# EAGLE design Nutrient Management Control (EAGLE 9.6.2)
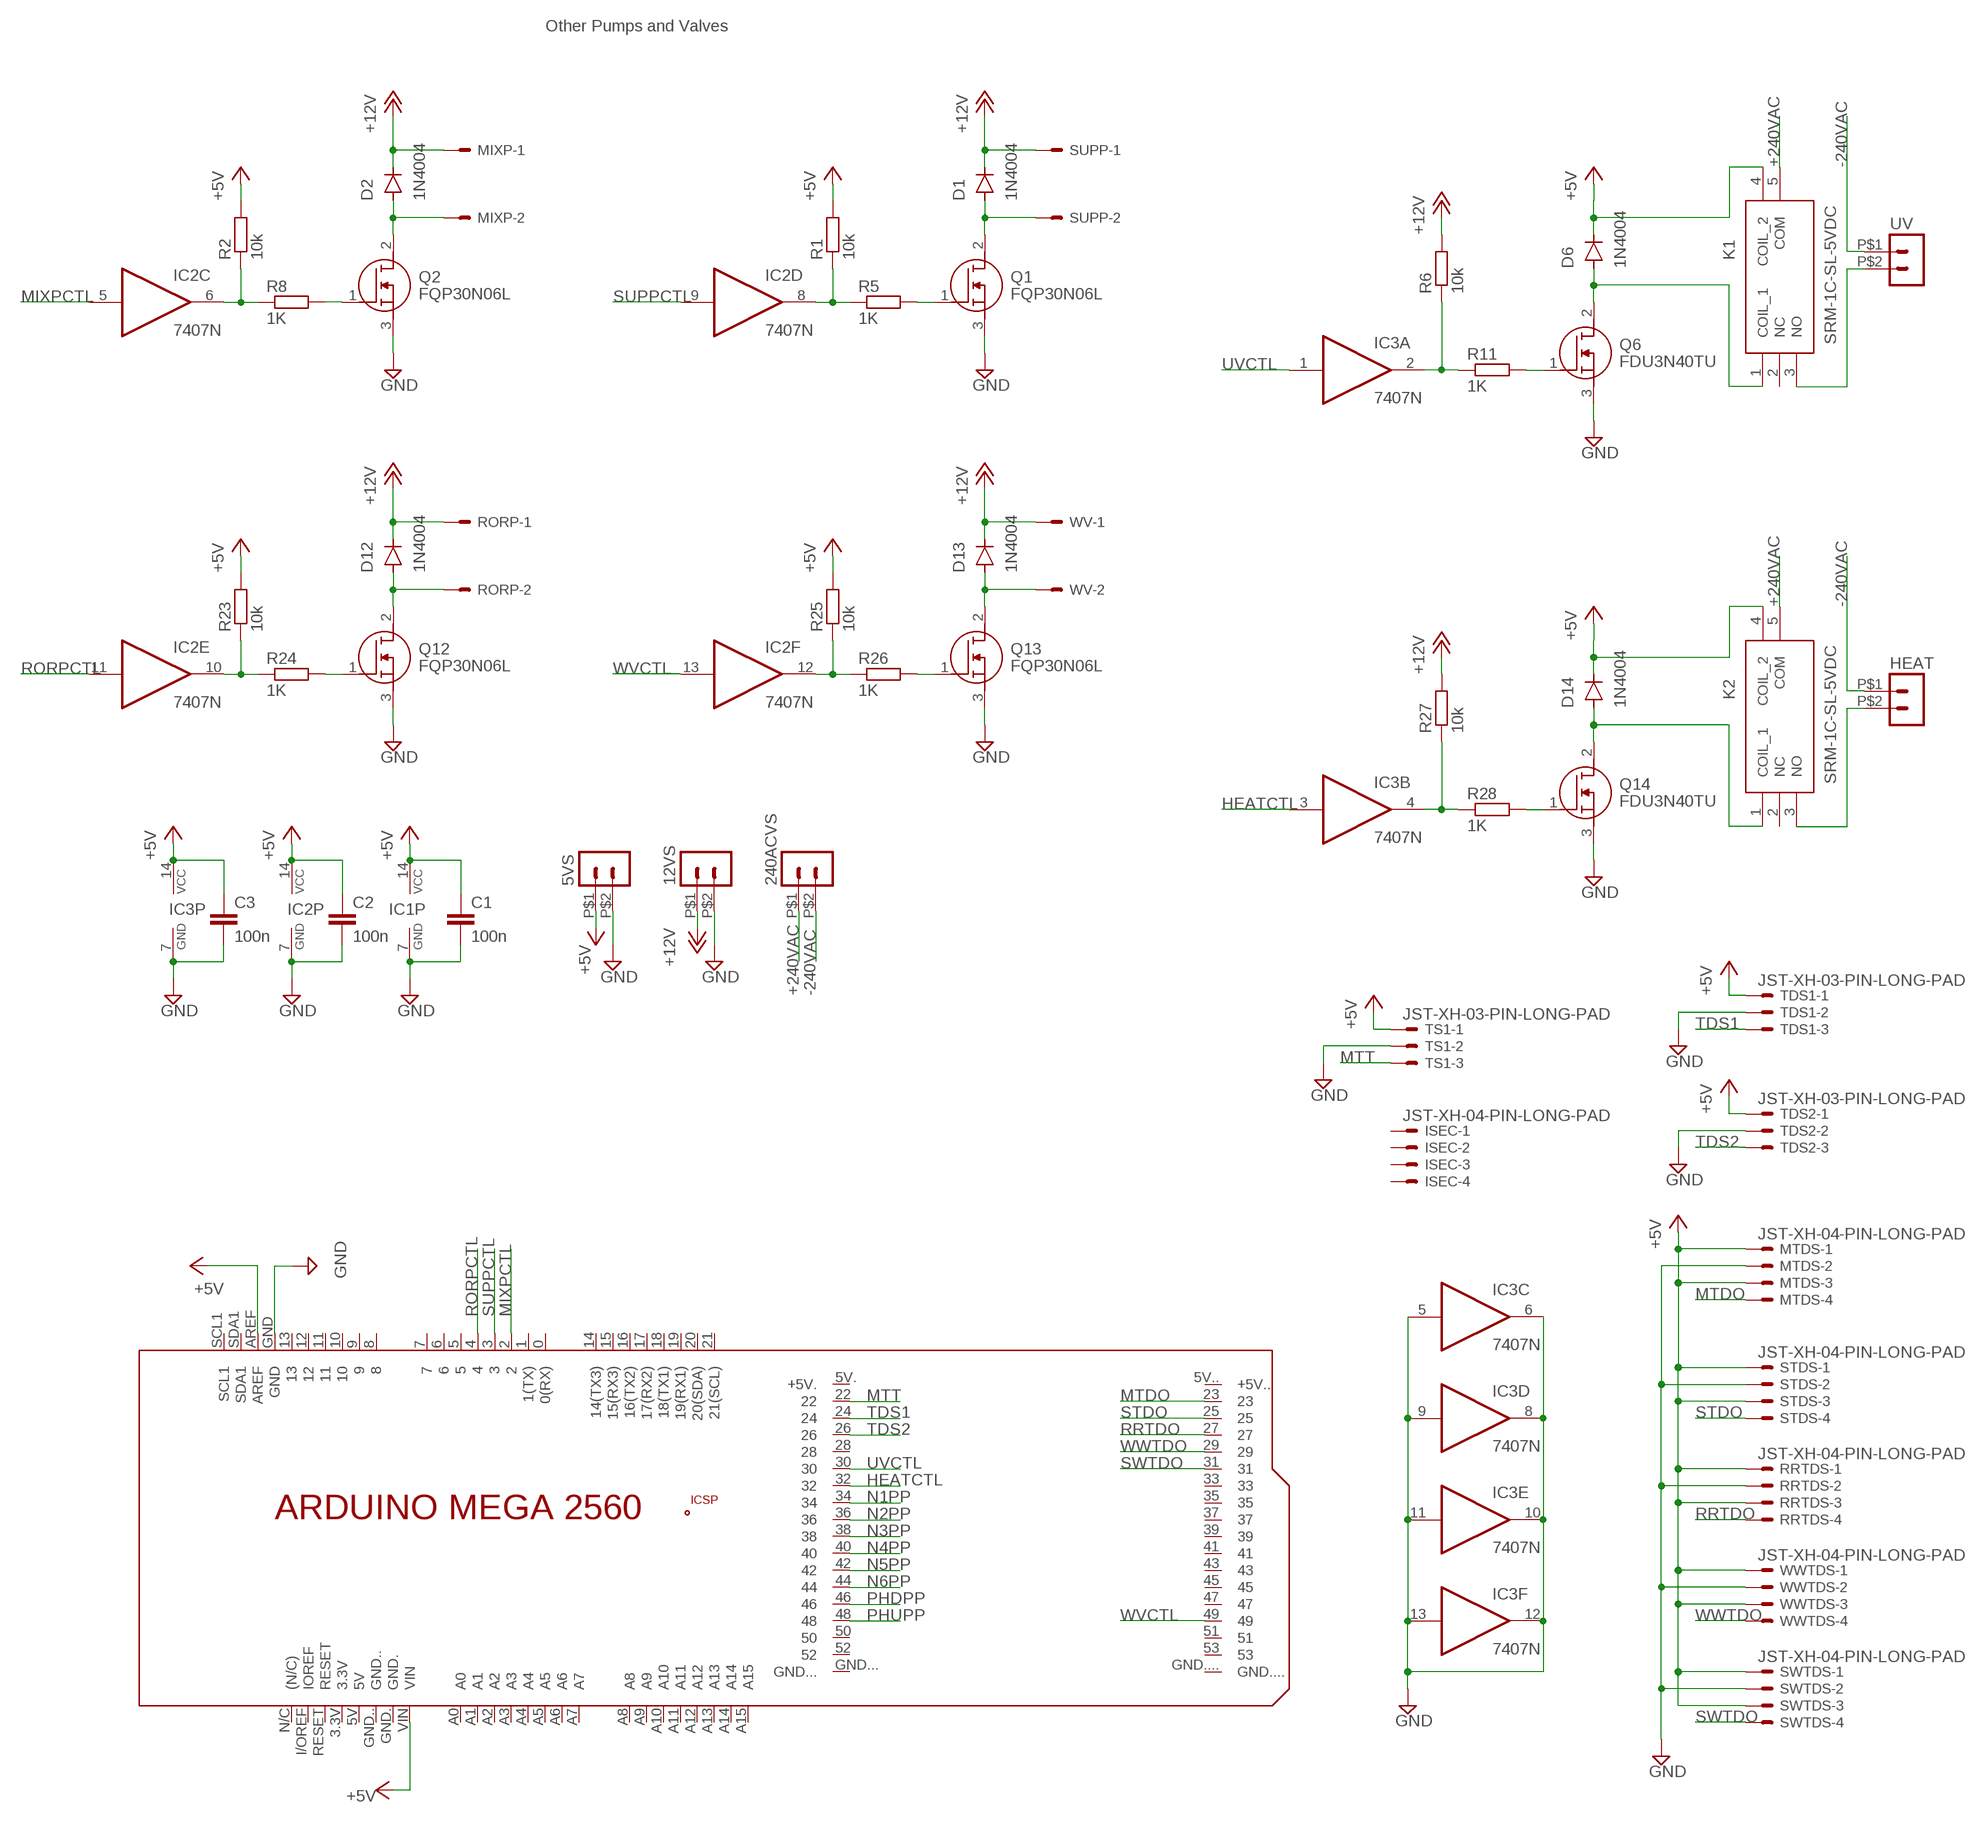
[diagram p0: schematic, sheet 1, part 1 of 2]
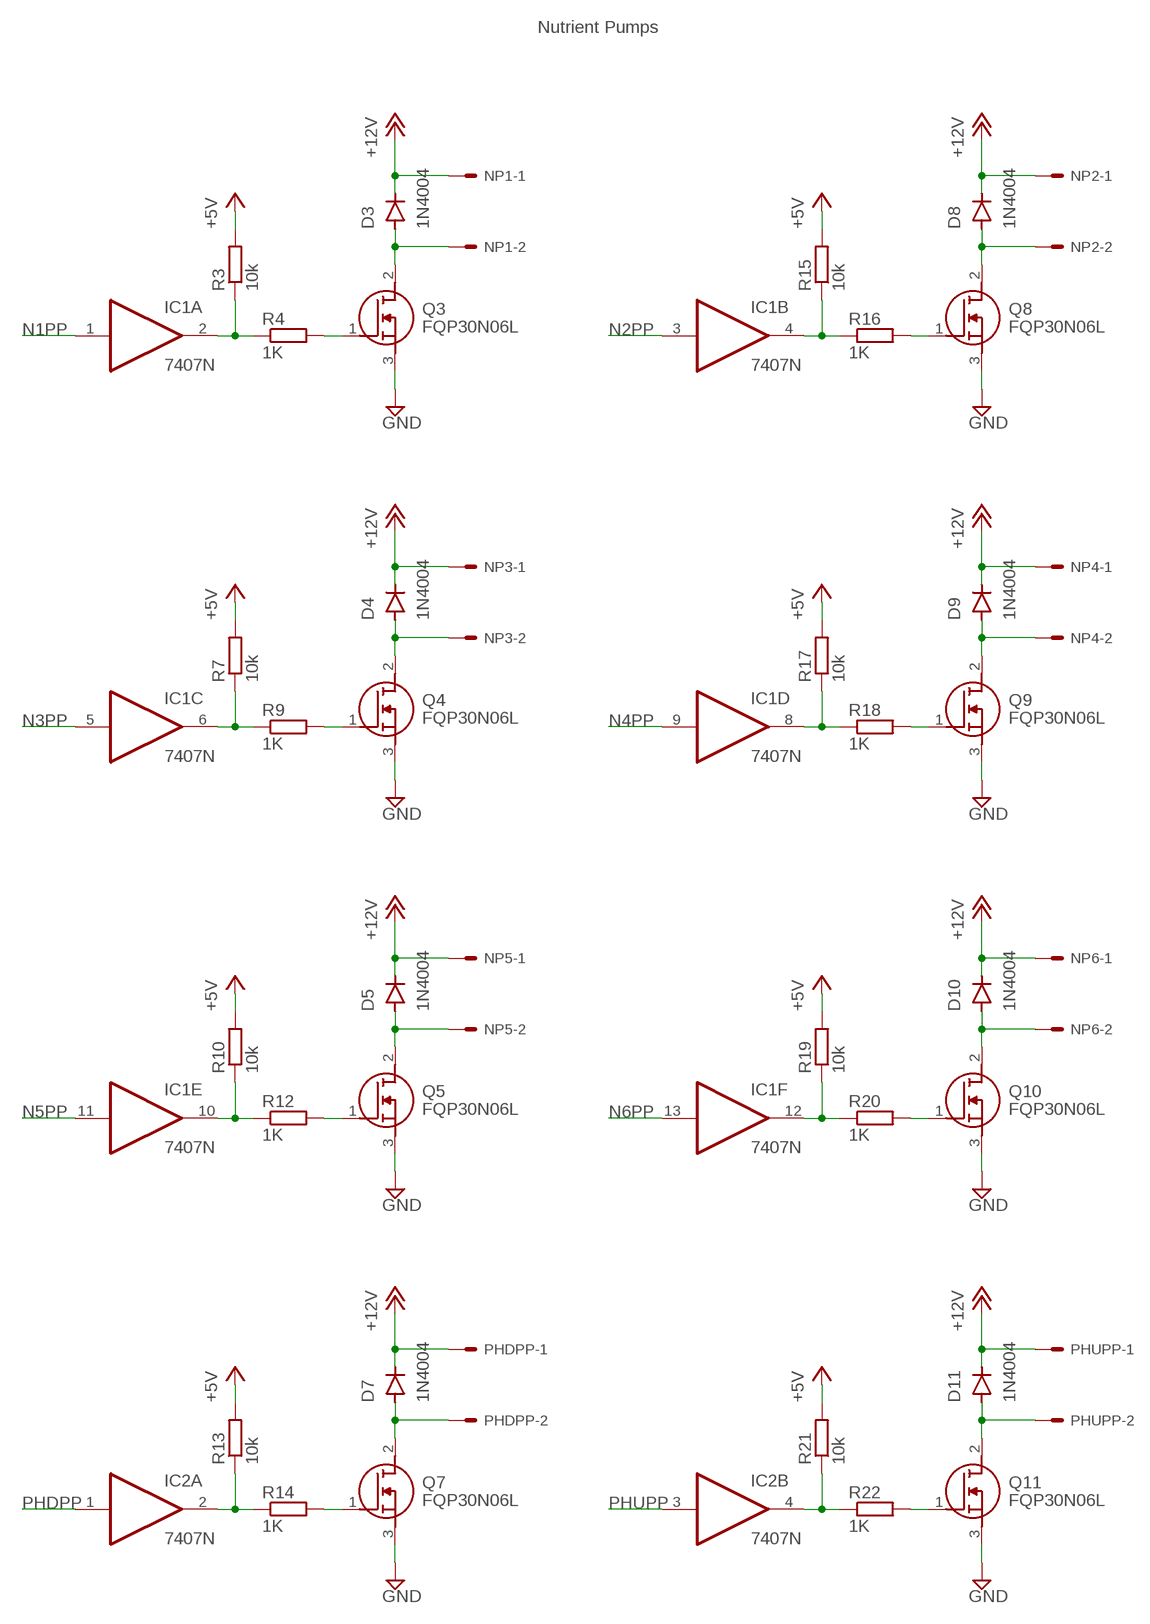
[diagram p1: schematic, sheet 1, part 2 of 2]

## Parts
5VS  HEADER_POS2_43650-0215  [43650-0215]
12VS  HEADER_POS2_43650-0215  [43650-0215]
240ACVS  HEADER_POS2_43650-0215  [43650-0215]
C1  100n  C-EU050-024X044  [C050-024X044]
C2  100n  C-EU050-024X044  [C050-024X044]
C3  100n  C-EU050-024X044  [C050-024X044]
D1  1N4004  [DO-41]
D2  1N4004  [DO-41]
D3  1N4004  [DO-41]
D4  1N4004  [DO-41]
D5  1N4004  [DO-41]
D6  1N4004  [DO-41]
D7  1N4004  [DO-41]
D8  1N4004  [DO-41]
D9  1N4004  [DO-41]
D10  1N4004  [DO-41]
D11  1N4004  [DO-41]
D12  1N4004  [DO-41]
D13  1N4004  [DO-41]
D14  1N4004  [DO-41]
HEAT  HEADER_POS2_43650-0215  [43650-0215]
IC1  7407N  [DIL14]
IC2  7407N  [DIL14]
IC3  7407N  [DIL14]
ISEC  JST-XH-04-PIN-LONG-PAD  [JST-XH-04-PACKAGE-LONG-PAD]
K1  SRM-1C-SL-5VDC  [SRM1CSL5VDC]
K2  SRM-1C-SL-5VDC  [SRM1CSL5VDC]
MIXP  JST-XH-02-PIN-LONG-PAD  [JST-XH-02-PACKAGE-LONG-PAD]
MTDS  JST-XH-04-PIN-LONG-PAD  [JST-XH-04-PACKAGE-LONG-PAD]
NP1  JST-XH-02-PIN-LONG-PAD  [JST-XH-02-PACKAGE-LONG-PAD]
NP2  JST-XH-02-PIN-LONG-PAD  [JST-XH-02-PACKAGE-LONG-PAD]
NP3  JST-XH-02-PIN-LONG-PAD  [JST-XH-02-PACKAGE-LONG-PAD]
NP4  JST-XH-02-PIN-LONG-PAD  [JST-XH-02-PACKAGE-LONG-PAD]
NP5  JST-XH-02-PIN-LONG-PAD  [JST-XH-02-PACKAGE-LONG-PAD]
NP6  JST-XH-02-PIN-LONG-PAD  [JST-XH-02-PACKAGE-LONG-PAD]
PCB2  ARDUINO_MEGA2560_SHIELD  [ARDUINO_MEGA2560_SHIELD]
PHDPP  JST-XH-02-PIN-LONG-PAD  [JST-XH-02-PACKAGE-LONG-PAD]
PHUPP  JST-XH-02-PIN-LONG-PAD  [JST-XH-02-PACKAGE-LONG-PAD]
Q1  FQP30N06L  [TO254P470X1016X2019-3P]
Q2  FQP30N06L  [TO254P470X1016X2019-3P]
Q3  FQP30N06L  [TO254P470X1016X2019-3P]
Q4  FQP30N06L  [TO254P470X1016X2019-3P]
Q5  FQP30N06L  [TO254P470X1016X2019-3P]
Q6  FDU3N40TU  [TO229P250X658X985-3P]
Q7  FQP30N06L  [TO254P470X1016X2019-3P]
Q8  FQP30N06L  [TO254P470X1016X2019-3P]
Q9  FQP30N06L  [TO254P470X1016X2019-3P]
Q10  FQP30N06L  [TO254P470X1016X2019-3P]
Q11  FQP30N06L  [TO254P470X1016X2019-3P]
Q12  FQP30N06L  [TO254P470X1016X2019-3P]
Q13  FQP30N06L  [TO254P470X1016X2019-3P]
Q14  FDU3N40TU  [TO229P250X658X985-3P]
R1  10k  R-EU_0204/7  [0204/7]
R2  10k  R-EU_0204/7  [0204/7]
R3  10k  R-EU_0204/7  [0204/7]
R4  1K  R-EU_0204/7  [0204/7]
R5  1K  R-EU_0204/7  [0204/7]
R6  10k  R-EU_0204/7  [0204/7]
R7  10k  R-EU_0204/7  [0204/7]
R8  1K  R-EU_0204/7  [0204/7]
R9  1K  R-EU_0204/7  [0204/7]
R10  10k  R-EU_0204/7  [0204/7]
R11  1K  R-EU_0204/7  [0204/7]
R12  1K  R-EU_0204/7  [0204/7]
R13  10k  R-EU_0204/7  [0204/7]
R14  1K  R-EU_0204/7  [0204/7]
R15  10k  R-EU_0204/7  [0204/7]
R16  1K  R-EU_0204/7  [0204/7]
R17  10k  R-EU_0204/7  [0204/7]
R18  1K  R-EU_0204/7  [0204/7]
R19  10k  R-EU_0204/7  [0204/7]
R20  1K  R-EU_0204/7  [0204/7]
R21  10k  R-EU_0204/7  [0204/7]
R22  1K  R-EU_0204/7  [0204/7]
R23  10k  R-EU_0204/7  [0204/7]
R24  1K  R-EU_0204/7  [0204/7]
R25  10k  R-EU_0204/7  [0204/7]
R26  1K  R-EU_0204/7  [0204/7]
R27  10k  R-EU_0204/7  [0204/7]
R28  1K  R-EU_0204/7  [0204/7]
RORP  JST-XH-02-PIN-LONG-PAD  [JST-XH-02-PACKAGE-LONG-PAD]
RRTDS  JST-XH-04-PIN-LONG-PAD  [JST-XH-04-PACKAGE-LONG-PAD]
STDS  JST-XH-04-PIN-LONG-PAD  [JST-XH-04-PACKAGE-LONG-PAD]
SUPP  JST-XH-02-PIN-LONG-PAD  [JST-XH-02-PACKAGE-LONG-PAD]
SWTDS  JST-XH-04-PIN-LONG-PAD  [JST-XH-04-PACKAGE-LONG-PAD]
TDS1  JST-XH-03-PIN-LONG-PAD  [JST-XH-03-PACKAGE-LONG-PAD]
TDS2  JST-XH-03-PIN-LONG-PAD  [JST-XH-03-PACKAGE-LONG-PAD]
TS1  JST-XH-03-PIN-LONG-PAD  [JST-XH-03-PACKAGE-LONG-PAD]
UV  HEADER_POS2_43650-0215  [43650-0215]
WV  JST-XH-02-PIN-LONG-PAD  [JST-XH-02-PACKAGE-LONG-PAD]
WWTDS  JST-XH-04-PIN-LONG-PAD  [JST-XH-04-PACKAGE-LONG-PAD]

## Nets
+5V [5V]: 5VS.P$1 C1.1 C2.1 C3.1 D6.C D14.C IC1.14(P:VCC) IC2.14(P:VCC) IC3.14(P:VCC) K1.4(COIL_2) K2.4(COIL_2) MTDS.1 MTDS.3 PCB2.AREF PCB2.VIN R1.2 R2.2 R3.2 R7.2 R10.2 R13.2 R15.2 R17.2 R19.2 R21.2 R23.2 R25.2 RRTDS.1 RRTDS.3 STDS.1 STDS.3 SWTDS.1 SWTDS.3 TDS1.1 TDS2.1 TS1.1 WWTDS.1 WWTDS.3
+12V [12V]: 12VS.P$1 D1.C D2.C D3.C D4.C D5.C D7.C D8.C D9.C D10.C D11.C D12.C D13.C MIXP.1 NP1.1 NP2.1 NP3.1 NP4.1 NP5.1 NP6.1 PHDPP.1 PHUPP.1 R6.2 R27.2 RORP.1 SUPP.1 WV.1
+240VAC [240VAC]: 240ACVS.P$1 K1.5(COM) K2.5(COM)
-240VAC [240VAC]: 240ACVS.P$2 HEAT.P$1 UV.P$1
GND: 5VS.P$2 12VS.P$2 C1.2 C2.2 C3.2 IC1.7(P:GND) IC2.7(P:GND) IC3.5(C:I) IC3.6(C:O) IC3.7(P:GND) IC3.8(D:O) IC3.9(D:I) IC3.10(E:O) IC3.11(E:I) IC3.12(F:O) IC3.13(F:I) MTDS.2 PCB2.GND Q1.3(S) Q2.3(S) Q3.3(S) Q4.3(S) Q5.3(S) Q6.3(S) Q7.3(S) Q8.3(S) Q9.3(S) Q10.3(S) Q11.3(S) Q12.3(S) Q13.3(S) Q14.3(S) RRTDS.2 STDS.2 SWTDS.2 TDS1.2 TDS2.2 TS1.2 WWTDS.2
HEATCTL: IC3.3(B:I) PCB2.32
MIXPCTL: IC2.5(C:I) PCB2.2
MTDO: MTDS.4 PCB2.23
MTT: PCB2.22 TS1.3
N1PP: IC1.1(A:I) PCB2.34
N2PP: IC1.3(B:I) PCB2.36
N3PP: IC1.5(C:I) PCB2.38
N4PP: IC1.9(D:I) PCB2.40
N5PP: IC1.11(E:I) PCB2.42
N6PP: IC1.13(F:I) PCB2.44
N$1 [Solenoids]: D2.A MIXP.2 Q2.2(D)
N$2 [Solenoids]: D3.A NP1.2 Q3.2(D)
N$3: IC2.8(D:O) R1.1 R5.1
N$4: Q2.1(G) R8.2
N$5: Q1.1(G) R5.2
N$6: IC1.2(A:O) R3.1 R4.1
N$7 [24VAC]: K1.3(NO) UV.P$2
N$8: Q3.1(G) R4.2
N$9: IC2.6(C:O) R2.1 R8.1
N$10 [Solenoids]: D1.A Q1.2(D) SUPP.2
N$11 [Solenoids]: D4.A NP3.2 Q4.2(D)
N$12: IC1.6(C:O) R7.1 R9.1
N$13: Q6.1(G) R11.2
N$14: Q4.1(G) R9.2
N$15 [Solenoids]: D5.A NP5.2 Q5.2(D)
N$16: IC1.10(E:O) R10.1 R12.1
N$17: IC3.2(A:O) R6.1 R11.1
N$18: Q5.1(G) R12.2
N$19 [Solenoids]: D7.A PHDPP.2 Q7.2(D)
N$20: IC2.2(A:O) R13.1 R14.1
N$21: D6.A K1.1(COIL_1) Q6.2(D)
N$22: Q7.1(G) R14.2
N$23 [Solenoids]: D8.A NP2.2 Q8.2(D)
N$24: IC1.4(B:O) R15.1 R16.1
N$25: Q8.1(G) R16.2
N$26 [Solenoids]: D9.A NP4.2 Q9.2(D)
N$27: IC1.8(D:O) R17.1 R18.1
N$28: Q9.1(G) R18.2
N$29 [Solenoids]: D10.A NP6.2 Q10.2(D)
N$30: IC1.12(F:O) R19.1 R20.1
N$31: Q10.1(G) R20.2
N$32 [Solenoids]: D11.A PHUPP.2 Q11.2(D)
N$33: IC2.4(B:O) R21.1 R22.1
N$34: Q11.1(G) R22.2
N$35 [Solenoids]: D12.A Q12.2(D) RORP.2
N$36: IC2.10(E:O) R23.1 R24.1
N$37: Q12.1(G) R24.2
N$38 [Solenoids]: D13.A Q13.2(D) WV.2
N$39: IC2.12(F:O) R25.1 R26.1
N$40: Q13.1(G) R26.2
N$41: D14.A K2.1(COIL_1) Q14.2(D)
N$42 [24VAC]: HEAT.P$2 K2.3(NO)
N$43: Q14.1(G) R28.2
N$44: IC3.4(B:O) R27.1 R28.1
PHDPP: IC2.1(A:I) PCB2.46
PHUPP: IC2.3(B:I) PCB2.48
RORPCTL: IC2.11(E:I) PCB2.4
RRTDO: PCB2.27 RRTDS.4
STDO: PCB2.25 STDS.4
SUPPCTL: IC2.9(D:I) PCB2.3
SWTDO: PCB2.31 SWTDS.4
TDS1: PCB2.24 TDS1.3
TDS2: PCB2.26 TDS2.3
UVCTL: IC3.1(A:I) PCB2.30
WVCTL: IC2.13(F:I) PCB2.49
WWTDO: PCB2.29 WWTDS.4
Unconnected: ISEC.1 ISEC.2 ISEC.3 ISEC.4 K1.2(NC) K2.2(NC) PCB2.0(0(RX)) PCB2.1(1(TX)) PCB2.3.3V PCB2.5 PCB2.5V PCB2.5V.(+5V.) PCB2.5V..(+5V..) PCB2.6 PCB2.7 PCB2.8 PCB2.9 PCB2.10 PCB2.11 PCB2.12 PCB2.13 PCB2.14(14(TX3)) PCB2.15(15(RX3)) PCB2.16(16(TX2)) PCB2.17(17(RX2)) PCB2.18(18(TX1)) PCB2.19(19(RX1)) PCB2.20(20(SDA)) PCB2.21(21(SCL)) PCB2.28 PCB2.33 PCB2.35 PCB2.37 PCB2.39 PCB2.41 PCB2.43 PCB2.45 PCB2.47 PCB2.50 PCB2.51 PCB2.52 PCB2.53 PCB2.+5V_ PCB2.A0 PCB2.A1 PCB2.A2 PCB2.A3 PCB2.A4 PCB2.A5 PCB2.A6 PCB2.A7 PCB2.A8 PCB2.A9 PCB2.A10 PCB2.A11 PCB2.A12 PCB2.A13 PCB2.A14 PCB2.A15 PCB2.GND. PCB2.GND.. PCB2.GND... PCB2.GND.... PCB2.GND__ PCB2.I/OREF(IOREF) PCB2.MISO PCB2.MOSI PCB2.N/C((N/C)) PCB2.RESET PCB2.RESET. PCB2.SCK PCB2.SCL1 PCB2.SDA1

## Notes on the sheet
- Nutrient Pumps
- Other Pumps and Valves

## Library data of the parts
5VS 12VS 240ACVS HEAT UV = Aeroponics Control:HEADER_POS2_?: Molex - Micro-Fit 3.0 Series connector, 3.00mm (0.118") pitch header, 2 positions.
C1-C3 = Aeroponics Control:C-EU: CAPACITOR, European symbol
D1-D14 = Aeroponics Control:1N4004: DIODE GEN PURP 400V 1A DO41 Manufacturer's datasheet <https://www.mccsemi.com/pdf/Products/1N4001-1N4007(DO-41).pdf>; CREATED_BY: PCBLayout.com; DIGIKEY_PART_NUMBER: 1N4004MSCT-ND; MANUFACTURER: Micro Commercial Co; MPN: 1N4004; PACKAGE: DO-41
IC1-IC3 = Aeroponics Control:74*07: Hex BUFFER, open collector high-voltage output
ISEC MTDS RRTDS STDS SWTDS WWTDS = Aeroponics Control:JST-XH-04-PIN: JST XH Connector 2 Pin Wire to board connector. Pitch: 2,54 mm, (0.100") Number of pins: 4 Created by Rembrandt Electronics www.rembrandtelectronics.com
K1 K2 = Aeroponics Control:SRM-1C-SL-5VDC: IMO PRECISION CONTROLS - SRM-1C-SL-5VDC - RELAY, SPDT, 277VAC, 250VDC, 10A Source: Datasheet <https://componentsearchengine.com/Datasheets/2/SRM-1C-SL-5VDC.pdf>; DESCRIPTION: IMO PRECISION CONTROLS - SRM-1C-SL-5VDC - RELAY, SPDT, 277VAC, 250VDC, 10A; HEIGHT: 15.5mm; MANUFACTURER_NAME: IMO PRECISION CONTROLS; MANUFACTURER_PART_NUMBER: SRM-1C-SL-5VDC
MIXP NP1-NP6 PHDPP PHUPP RORP SUPP WV = Aeroponics Control:JST-XH-02-PIN: JST XH Connector 2 Pin Wire to board connector. Pitch: 2,54 mm, (0.100") Number of pins: 2 Created by Rembrandt Electronics www.rembrandtelectronics.com
PCB2 = Aeroponics Control:ARDUINO_MEGA2560_SHIELD: Device for representing an Arduino Mega 2560 board with a footprint in an EAGLE design. Created by Dave Young for Element14. More EAGLE documentation at: http://www.element14.com/community/community/knode/cadsoft_eagle
Q1-Q5 Q7-Q13 = Aeroponics Control:FQP30N06L: FQP30N06L N-Channel MOSFET, 32 A, 60 V QFET, 3-Pin TO-220 ON Semiconductor Source: Datasheet <http://uk.rs-online.com/web/p/products/8075863P>; DESCRIPTION: FQP30N06L N-Channel MOSFET, 32 A, 60 V QFET, 3-Pin TO-220 ON Semiconductor; HEIGHT: 4.7mm; MANUFACTURER_NAME: onsemi; MANUFACTURER_PART_NUMBER: FQP30N06L; RS_PART_NUMBER: 8075863P; RS_PRICE-STOCK: http://uk.rs-online.com/web/p/products/8075863P
Q6 Q14 = Aeroponics Control:FDU3N40TU: Fairchild FDU3N40TU N-channel MOSFET Transistor, 2 A, 400 V, 3-Pin IPAK Source: Datasheet <http://uk.rs-online.com/web/p/products/8070701P>; DESCRIPTION: Fairchild FDU3N40TU N-channel MOSFET Transistor, 2 A, 400 V, 3-Pin IPAK; HEIGHT: 2.5mm; MANUFACTURER_NAME: onsemi; MANUFACTURER_PART_NUMBER: FDU3N40TU; RS_PART_NUMBER: 8070701P; RS_PRICE-STOCK: http://uk.rs-online.com/web/p/products/8070701P
R1-R28 = Aeroponics Control:R-EU_: RESISTOR, European symbol
TDS1 TDS2 TS1 = Aeroponics Control:JST-XH-03-PIN: JST XH Connector 2 Pin Wire to board connector. Pitch: 2,54 mm, (0.100") Number of pins: 3 Created by Rembrandt Electronics www.rembrandtelectronics.com

## Net classes
1 240VAC: width 0.254 mm, drill 0.254 mm, clearance 0.508 mm
2 24VAC: width 0.762 mm, drill 0.762 mm, clearance 0.508 mm
3 5V: width 0.508 mm, drill 0.508 mm, clearance 0.254 mm
4 12V: width 2.032 mm, drill 2.032 mm, clearance 0.254 mm
5 Pumps: width 0.762 mm, drill 0.762 mm, clearance 0.254 mm
6 Solenoids: width 0.254 mm, drill 0.254 mm, clearance 0.254 mm

## Board
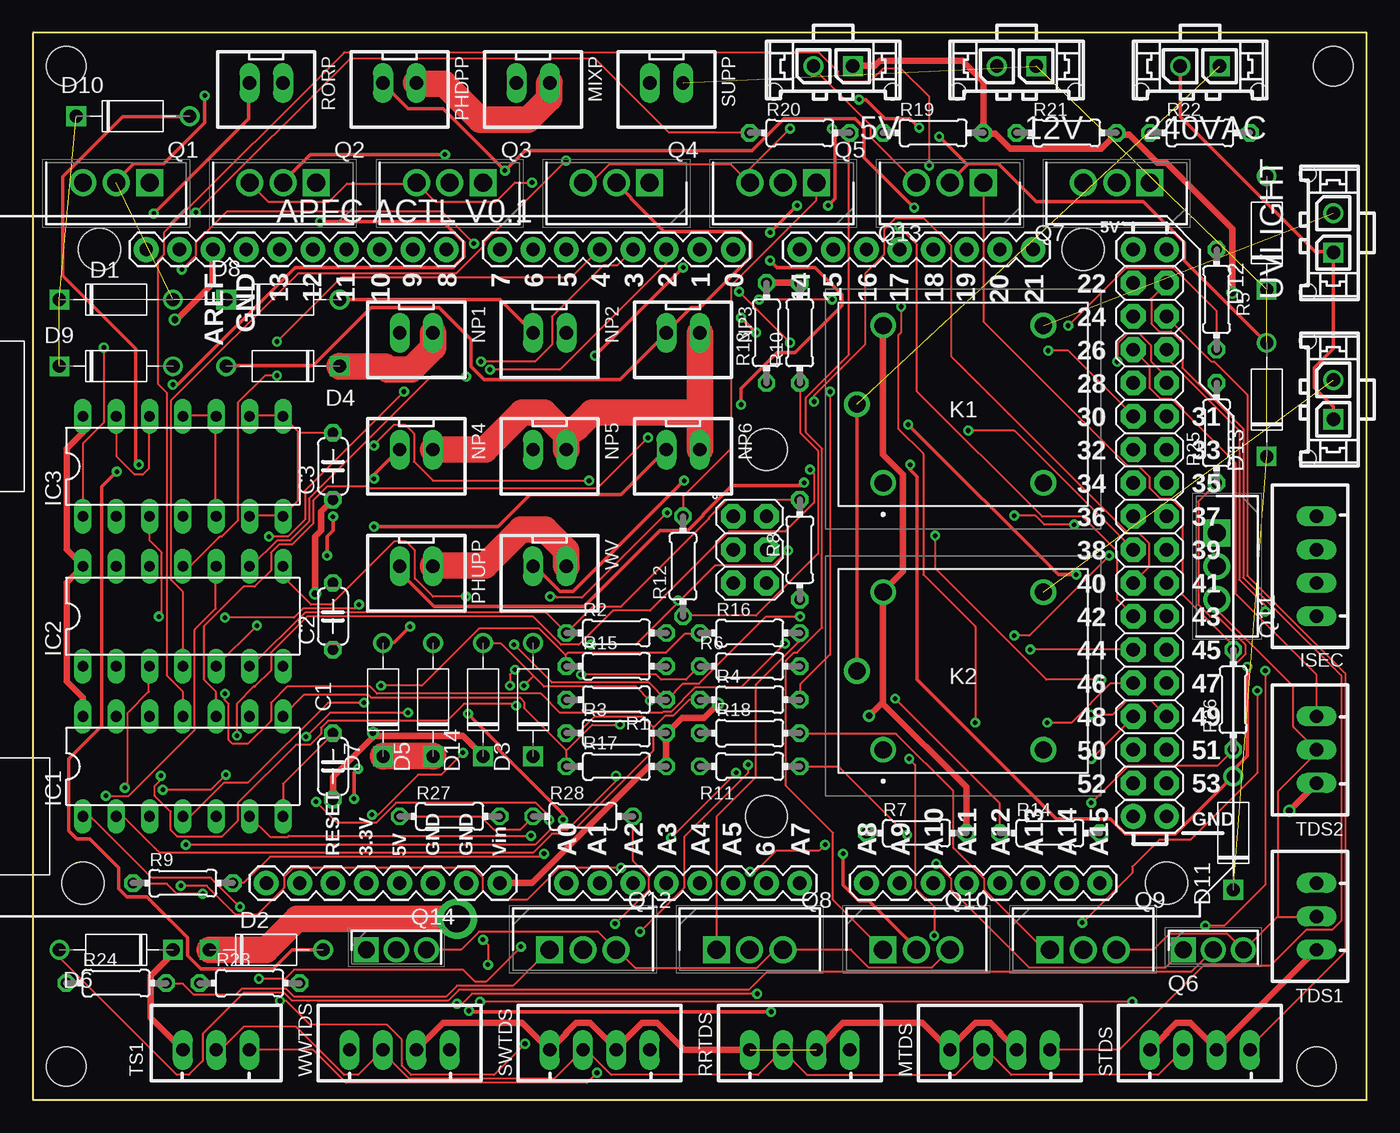
[diagram p2: board, top side]
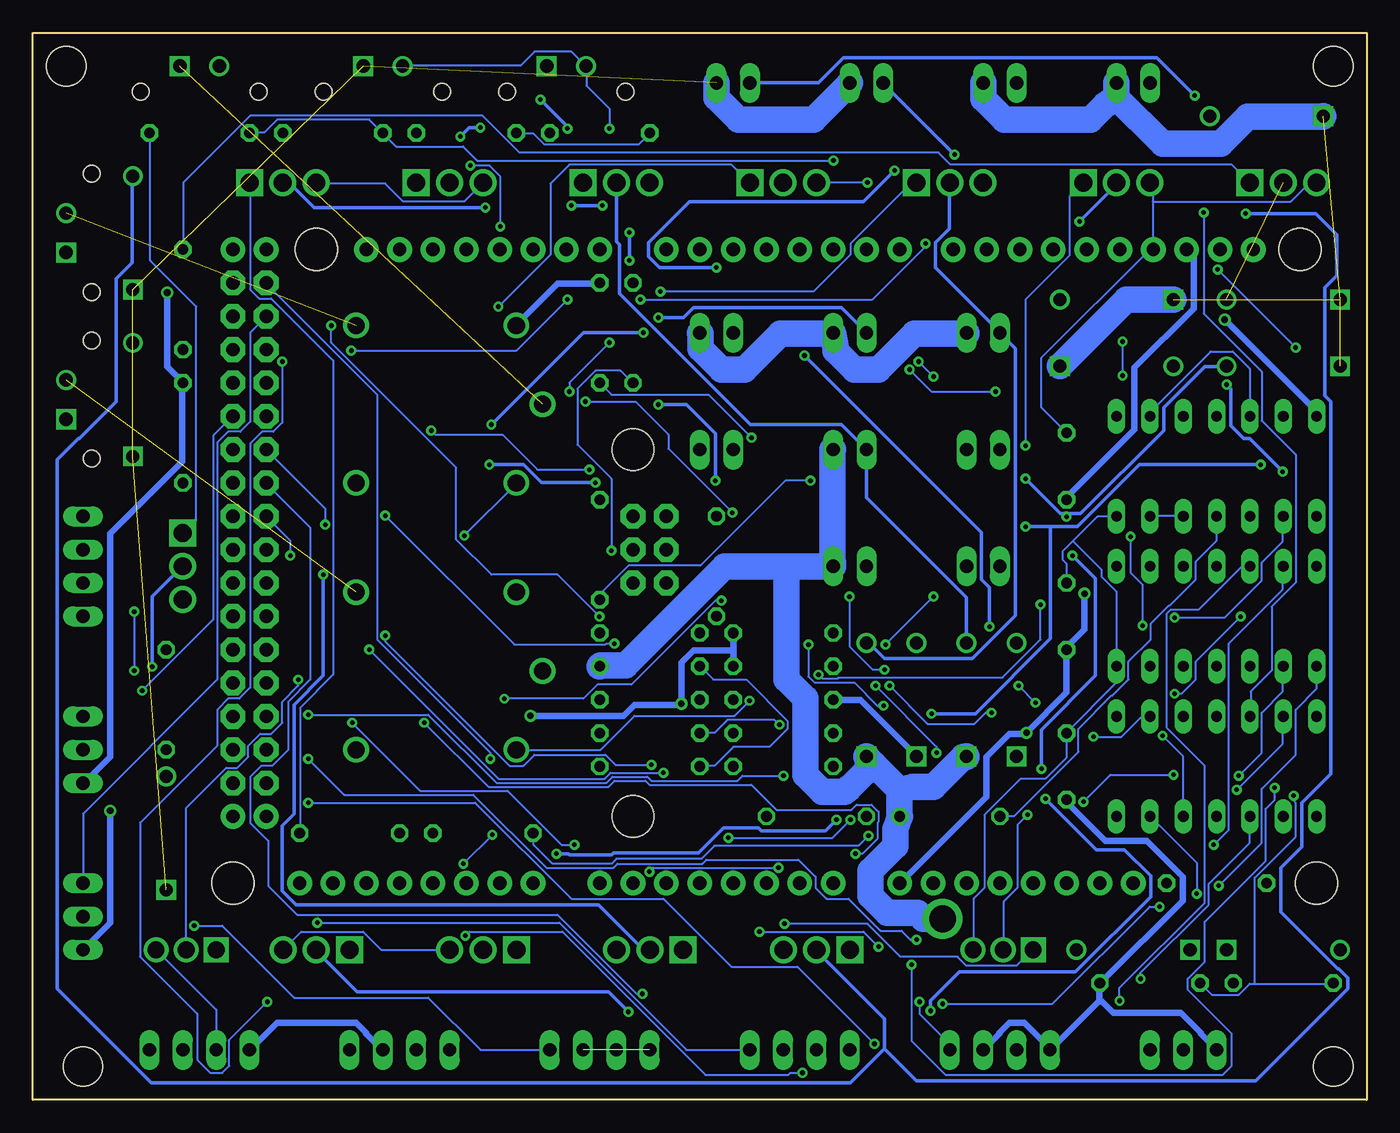
[diagram p3: board, bottom side, seen from below]

Size 101.6 x 81.28 mm. Coordinates in mm from the lower left corner, seen from the top.
Outline: 0,0 101.6,0 101.6,81.28 0,81.28 0,0
Copper layers (1*16): Top 0.035mm / dielectric 1.5mm / Bottom 0.035mm
Design rules "default": minimum track width 6mil, minimum drill 0.35mm, track to track 6mil, track to pad 6mil, pad to pad 6mil, via to via 6mil, smd to smd 6mil, copper to edge 40mil, drill to drill 6mil, minimum pad ring 10mil, minimum via ring 8mil, stop-mask expansion 4mil, vias tented up to drill 0mil, thermal gap 10mil
Holes 3 mm at 2.54,78.74 99.06,78.74 97.79,2.54 2.54,2.54

### Footprints (pad centres in the part's own frame; a part is rotated, then mirrored left to right if it is on the bottom)
43650-0215 = drill 1.02 square: P$1 1.5,0 | drill 1.02: P$2 -1.5,0 | hole 1.27: 4.5,-1.96; -4.5,-1.96
C050-024X044 = drill 0.813 octagon: 1 -2.54,0; 2 2.54,0
DO-41 = drill 1: A 4.325,0 | drill 1 square: C -4.325,0
DIL14 = drill 0.813 long: 1 -7.62,-3.81; 2 -5.08,-3.81; 3 -2.54,-3.81; 4 0,-3.81; 5 2.54,-3.81; 6 5.08,-3.81; 7 7.62,-3.81; 8 7.62,3.81; 9 5.08,3.81; 10 2.54,3.81; 11 0,3.81; 12 -2.54,3.81; 13 -5.08,3.81; 14 -7.62,3.81
JST-XH-04-PACKAGE-LONG-PAD = drill 1.016 long: 1 -3.81,0; 2 -1.27,0; 3 1.27,0; 4 3.81,0
SRM1CSL5VDC = drill 1.3 pad 1.95: 1 0,0; 2 12.2,0; 3 12.2,12; 4 0,12; 5 -2,6
JST-XH-02-PACKAGE-LONG-PAD = drill 1.016 long: 1 -1.27,0; 2 1.27,0
ARDUINO_MEGA2560_SHIELD = drill 1.016 pad 1.88: 0 63.5,50.8; 1 60.96,50.8; 2 58.42,50.8; 3 55.88,50.8; 3.3V 35.56,2.54; 4 53.34,50.8; 5 50.8,50.8; 5V 38.1,2.54; 5V. 93.98,50.8; 5V.. 96.52,50.8; 6 48.26,50.8; 7 45.72,50.8; 8 41.656,50.8; 9 39.116,50.8; 10 36.576,50.8; 11 34.036,50.8; 12 31.496,50.8; 13 28.956,50.8; 14 68.58,50.8; 15 71.12,50.8; 16 73.66,50.8; 17 76.2,50.8; 18 78.74,50.8; 19 81.28,50.8; 20 83.82,50.8; 21 86.36,50.8; A0 50.8,2.54; A1 53.34,2.54; A2 55.88,2.54; A3 58.42,2.54; A4 60.96,2.54; A5 63.5,2.54; A6 66.04,2.54; A7 68.58,2.54; A8 73.66,2.54; A9 76.2,2.54; A10 78.74,2.54; A11 81.28,2.54; A12 83.82,2.54; A13 86.36,2.54; A14 88.9,2.54; A15 91.44,2.54; AREF 23.876,50.8; GND 26.416,50.8; GND. 43.18,2.54; GND.. 40.64,2.54; GND... 93.98,7.62; GND.... 96.52,7.62; I/OREF 30.48,2.54; N/C 27.94,2.54; RESET 33.02,2.54; SCL1 18.796,50.8; SDA1 21.336,50.8; VIN 45.72,2.54 | drill 1.016 pad 1.88 octagon: 22 93.98,48.26; 23 96.52,48.26; 24 93.98,45.72; 25 96.52,45.72; 26 93.98,43.18; 27 96.52,43.18; 28 93.98,40.64; 29 96.52,40.64; 30 93.98,38.1; 31 96.52,38.1; 32 93.98,35.56; 33 96.52,35.56; 34 93.98,33.02; 35 96.52,33.02; 36 93.98,30.48; 37 96.52,30.48; 38 93.98,27.94; 39 96.52,27.94; 40 93.98,25.4; 41 96.52,25.4; 42 93.98,22.86; 43 96.52,22.86; 44 93.98,20.32; 45 96.52,20.32; 46 93.98,17.78; 47 96.52,17.78; 48 93.98,15.24; 49 96.52,15.24; 50 93.98,12.7; 51 96.52,12.7; 52 93.98,10.16; 53 96.52,10.16; +5V_ 66.04,30.48; GND__ 66.04,25.4; MISO 63.5,30.48; MOSI 66.04,27.94; RESET. 63.5,25.4; SCK 63.5,27.94 | hole 3.2: 15.24,50.8; 13.97,2.54; 66.04,35.56; 66.04,7.62; 90.17,50.8; 96.52,2.54
TO254P470X1016X2019-3P = drill 1.37 pad 2.055 square: 1 0,0 | drill 1.37 pad 2.055: 2 2.535,0; 3 5.07,0
TO229P250X658X985-3P = drill 1.27 pad 1.905 square: 1 0,0 | drill 1.27 pad 1.905: 2 2.29,0; 3 4.58,0
0204/7 = drill 0.813 octagon: 1 -3.81,0; 2 3.81,0
JST-XH-03-PACKAGE-LONG-PAD = drill 1.016 long: 1 -2.54,0; 2 0,0; 3 2.54,0

### Placement (x,y rotation side)
5VS  60.96,78.74 0 top
12VS  74.93,78.74 0 top
240ACVS  88.9,78.74 0 top
C1  22.86,25.4 90 top
C2  22.86,36.83 90 top
C3  22.86,48.26 90 top
D1  6.35,60.96 0 top
D2  17.78,11.43 0 top
D3  38.1,30.48 90 top
D4  19.05,55.88 180 top
D5  30.48,30.48 90 top
D6  6.35,11.43 180 top
D7  26.67,30.48 90 top
D8  19.05,60.96 0 top
D9  6.35,55.88 0 top
D10  7.62,74.93 0 top
D11  91.44,20.32 90 top
D12  93.98,66.04 90 top
D13  93.98,53.34 90 top
D14  34.29,30.48 90 top
HEAT  99.06,53.34 270 top
IC1  11.43,25.4 0 top
IC2  11.43,36.83 0 top
IC3  11.43,48.26 0 top
ISEC  97.79,40.64 90 top
K1  64.77,46.99 0 top
K2  64.77,26.67 0 top
MIXP  38.1,77.47 180 top
MTDS  73.66,3.81 0 top
NP1  29.21,58.42 180 top
NP2  39.37,58.42 180 top
NP3  49.53,58.42 180 top
NP4  29.21,49.53 180 top
NP5  39.37,49.53 180 top
NP6  49.53,49.53 180 top
PCB2  -10.16,13.97 0 top
PHDPP  27.94,77.47 180 top
PHUPP  29.21,40.64 180 top
Q1  8.89,69.85 180 top
Q2  21.59,69.85 180 top
Q3  34.29,69.85 180 top
Q4  46.99,69.85 180 top
Q5  59.69,69.85 180 top
Q6  87.63,11.43 0 top
Q7  85.09,69.85 180 top
Q8  52.07,11.43 0 top
Q9  77.47,11.43 0 top
Q10  64.77,11.43 0 top
Q11  90.17,43.18 270 top
Q12  39.37,11.43 0 top
Q13  72.39,69.85 180 top
Q14  25.4,11.43 0 top
R1  44.45,30.48 180 top
R2  44.45,35.56 0 top
R3  44.45,27.94 0 top
R4  54.61,30.48 0 top
R5  90.17,60.96 90 top
R6  54.61,33.02 0 top
R7  67.31,20.32 0 top
R8  58.42,41.91 270 top
R9  11.43,16.51 0 top
R10  58.42,58.42 90 top
R11  54.61,25.4 0 top
R12  49.53,40.64 90 top
R13  55.88,58.42 90 top
R14  77.47,20.32 0 top
R15  44.45,33.02 0 top
R16  54.61,35.56 0 top
R17  44.45,25.4 0 top
R18  54.61,27.94 0 top
R19  68.58,73.66 0 top
R20  58.42,73.66 0 top
R21  78.74,73.66 0 top
R22  88.9,73.66 0 top
R23  16.51,8.89 0 top
R24  6.35,8.89 0 top
R25  90.17,50.8 90 top
R26  91.44,30.48 90 top
R27  31.75,21.59 0 top
R28  41.91,21.59 0 top
RORP  17.78,77.47 180 top
RRTDS  58.42,3.81 0 top
STDS  88.9,3.81 0 top
SUPP  48.26,77.47 180 top
SWTDS  43.18,3.81 0 top
TDS1  97.79,13.97 90 top
TDS2  97.79,26.67 90 top
TS1  13.97,3.81 0 top
UV  99.06,66.04 270 top
WV  39.37,40.64 180 top
WWTDS  27.94,3.81 0 top

### Tracks (layer width: path | path; a pad name or v marks a point on that pad's centre or on a via)
+5V  (via drill 0.51)  (1 unrouted)
  Top 0.508: RRTDS.3 59.74,3.81 60.96,5.03 60.96,5.11 61.72,5.87 67.74,5.87 69.8,3.81 MTDS.1 69.95,4.04 71.78,5.87 72.92,5.87 73.69,5.11 73.69,5.03 74.91,3.81 MTDS.3 | STDS.1 85.11,3.81 86.33,5.03 86.33,5.11 87.1,5.87 88.16,5.87 90.22,3.81 STDS.3 90.3,3.96 97.77,11.43 TDS1.1 | 5VS.P$1 62.48,78.79 64.16,78.79 64.54,79.17 70.79,79.17 72.39,77.57 72.39,73.84 R19.2 72.39,73.61 73.3,73.61 74.45,72.47 81.38,72.47 82.53,73.61 R21.2 82.75,73.53 83.52,73.53 85.65,71.4 86.33,71.4 91.36,66.37 v91.36,61.49 | v95.71,22.02 97.77,24.08 TDS2.1 | R13.2 55.93,62.26 58.37,62.26 R10.2 | 64.77,30.18 71.09,23.85 71.09,20.34 R7.2 | 64.77,30.18 64.77,38.63 K2.4 64.92,38.86 66.29,40.23 66.29,47.62 64.77,49.15 64.77,58.98 K1.4 | IC1.14 3.81,29.26 3.81,30.63 2.59,31.85 2.59,39.4 3.81,40.62 IC2.14 3.66,40.84 2.59,41.91 2.59,49.61 3.81,50.83 3.81,52.05 IC3.14 | v10.82,59.44 10.97,59.44 13.72,62.18 PCB2.AREF | C1.1 22.86,24.61 25.98,27.74 | 25.98,27.74 32.77,27.74 34.29,26.21 D14.C | v25.91,27.96 25.98,27.74 | PCB2.VIN 35.59,16.54 38.02,16.54 46.86,25.38 48.01,25.38 R17.2 48.23,25.45 48.23,27.89 R3.2 48.46,28.12 49.45,29.11 51.13,29.11 v52.2,30.18 | RRTDS.1 54.56,3.81 49.61,3.81 47.55,5.87 46.41,5.87 44.58,4.04 SWTDS.3 44.5,3.81 42.44,5.87 41.38,5.87 40.62,5.11 40.62,5.03 39.4,3.81 SWTDS.1 39.17,3.96 37.26,5.87 31.24,5.87 29.18,3.81 WWTDS.3 | TS1.1 8.99,6.25 8.99,9.45 10.67,11.12 10.67,11.43 D6.C | C3.1 21.95,44.81 21.95,43.36 21.49,42.9 v21.49,38.56 | v63.7,29.26 64.54,30.1 64.77,30.18
  Bottom 0.508: MTDS.3 74.98,3.81 76.2,5.03 76.2,5.11 76.96,5.87 82.98,5.87 85.04,3.81 STDS.1 | TDS2.1 97.77,24.08 95.71,26.14 95.71,43.13 90.22,48.62 90.22,54.56 R25.2 90.3,54.79 91.36,55.85 v91.36,61.49 | v95.71,22.02 95.71,13.49 97.77,11.43 TDS1.1 | R10.2 58.45,62.18 61.65,62.18 64.77,59.05 K1.4 | C3.1 22.86,45.87 17.68,51.05 17.68,55.78 13.18,60.27 13.18,64.24 PCB2.AREF | v10.82,59.44 3.81,52.43 3.81,52.12 IC3.14 | R1.2 40.62,30.48 38.56,30.48 34.29,26.21 D14.C | 48.23,34.21 48.23,35.51 R2.2 | 48.23,34.21 48.23,33.07 R15.2 | 48.23,34.21 48.46,34.21 51.28,34.21 52.2,33.3 v52.2,30.18 52.43,30.1 55.78,30.1 56.62,29.26 v63.7,29.26 | PCB2.VIN 35.51,16.54 28.96,23.09 28.96,26.14 27.2,27.89 26.14,27.89 v25.91,27.96 22.86,31.01 C2.1 22.78,34.52 21.49,35.81 v21.49,38.56 | 20.34,7.54 20.34,8.84 R23.2 20.12,9.07 14.02,15.16 14.02,16.99 16.76,19.74 19.89,19.74 22.86,22.71 C1.1 | 20.34,7.54 24.08,3.81 WWTDS.1 24.23,4.04 26.06,5.87 27.2,5.87 27.96,5.11 27.96,5.03 29.18,3.81 WWTDS.3 | TS1.1 12.65,5.03 12.65,5.11 14.17,6.63 19.28,6.63 20.12,7.47 20.34,7.54
+12V  (via drill 2.03)  (7 unrouted)
  Top 2.032: MIXP.1 39.32,77.42 39.32,76.28 37.72,74.68 34.06,74.68 31.32,77.42 29.26,77.42 PHDPP.1 | D7.C 26.67,26.21 30.48,26.21 D5.C | v32.31,13.79 20.12,13.79 17.75,11.43 13.49,11.43 D2.C | D4.C 23.39,55.85 26.82,55.85 27.05,55.63 28.8,55.63 30.48,57.3 30.48,58.37 NP1.1 | 50.83,52.35 50.83,58.37 NP3.1 | 50.83,52.35 50.83,49.53 NP6.1 | NP4.1 34.44,49.53 37.26,52.35 38.94,52.35 40.62,50.67 | 40.62,50.67 40.62,49.53 NP5.1 | PHUPP.1 30.48,40.69 34.44,40.69 37.19,43.43 39.01,43.43 40.62,41.83 40.62,40.69 WV.1 | 50.83,52.35 49.84,52.35 42.6,52.35 41.45,51.21 40.62,50.67
  Bottom 2.032: 19.05,76.35 15.54,72.85 11.12,72.85 9.07,74.91 3.35,74.91 D10.C | 19.05,76.35 19.05,77.42 RORP.1 | PHDPP.1 29.18,77.42 29.18,76.28 27.58,74.68 21.03,74.68 19.89,75.82 19.05,76.35 | SUPP.1 49.53,77.42 49.53,76.35 47.85,74.68 42.14,74.68 39.4,77.42 MIXP.1 | 35.59,23.62 35.59,21.64 R27.2 35.89,20.65 35.89,19.36 37.8,17.45 37.8,15.54 36.5,14.25 34.21,14.25 33.76,13.79 v32.31,13.79 | 37.57,25.6 38.1,26.14 D3.C | 37.57,25.6 35.59,23.62 | D5.C 30.48,26.14 30.71,26.14 32.99,23.85 34.59,23.85 35.59,23.62 | D8.C 14.78,60.96 18.29,60.96 23.32,55.93 D4.C | NP3.1 50.75,58.37 50.75,57.23 49.15,55.63 47.4,55.63 44.65,58.37 40.69,58.37 NP2.1 40.46,57.38 40.46,57.07 39.01,55.63 37.19,55.63 34.44,58.37 30.48,58.37 NP1.1 | 44.2,40.62 40.69,40.62 WV.1 40.69,41.6 40.69,49.53 NP5.1 | 44.2,40.62 48.92,40.62 56.46,33.07 58.37,33.07 R6.2 | 37.57,25.6 38.25,24.92 39.47,23.7 39.55,23.7 39.78,23.47 41.45,23.47 42.75,24.77 42.75,30.56 44.2,32 44.2,39.62 44.2,40.62
+240VAC  (1 unrouted)
  Top 0.254: K2.5 62.79,32.69 62.79,52.96 K1.5
-240VAC
  Top 0.254: HEAT.P$1 99.06,51.89 99.06,52.81 97.61,54.25 97.61,55.78 99.06,57.23 99.06,64.47 UV.P$1 98.98,64.62 97.69,64.62 87.4,74.91 87.4,78.72 240ACVS.P$2
GND  (via drill 0.35)
  Top 0.152: TS1.2 14.02,3.81 14.33,3.81 16.08,5.56 20.04,5.56 23.7,1.91 24.77,1.91 WWTDS.2 26.59,3.66 28.65,1.6 39.7,1.6 SWTDS.2 42.14,3.81 44.04,1.91 55.24,1.91 RRTDS.2 57.15,3.73 58.98,1.91 70.26,1.91 72.16,3.81 MTDS.2 72.62,3.81 74.52,1.91 85.72,1.91 STDS.2 | Q14.3 30.02,11.43 32.61,11.43 33.98,12.8 43.05,12.8 44.42,11.43 Q12.3 44.5,11.43 45.87,10.06 55.17,10.06 56.54,11.43 57.07,11.43 Q8.3 62.33,11.43 63.7,10.06 68.43,10.06 69.8,11.43 Q10.3 | 94.87,13.95 94.79,13.95 92.28,11.43 Q6.3 90.98,12.65 86.56,12.65 85.34,11.43 82.6,11.43 Q9.3 | 94.87,13.95 97.77,13.95 TDS1.2 | 97.77,26.67 97.77,26.44 94.87,23.55 94.87,13.95 | 97.77,26.67 TDS2.2 97.77,26.67 | 97.77,26.67 96.01,28.42 96.01,31.47 90.22,37.26 90.22,38.1 Q11.3 | Q4.3 41.99,69.88 42.52,69.88 43.89,71.25 53.19,71.25 54.56,69.88 Q5.3 54.1,70.41 v57.68,73.99 | 5VS.P$2 59.51,78.72 59.51,78.56 63.86,74.22 63.86,73.3 67.28,69.88 Q13.3 | Q2.3 16.54,69.8 17.91,68.43 22.55,68.43 23.93,69.8 29.18,69.8 Q3.3 29.26,69.8 30.63,68.43 35.28,68.43 36.73,69.88 v38.02,69.88 | IC3.13 6.4,52.05 6.4,49 7.77,47.62 8.38,47.62 8.84,48.08 8.84,52.05 IC3.12 | IC3.9 16.54,52.12 19.05,52.12 IC3.8 19.05,52.05 20.23,50.86 | 20.23,50.86 20.27,50.83 22.86,50.83 C3.2 | IC1.7 19.05,21.64 19.05,24.08 22.86,27.89 C1.2 | IC3.11 11.43,52.12 13.95,52.12 IC3.10 13.95,52.05 13.95,44.5 IC3.5 | 19.05,44.5 16.54,44.5 IC3.6 | 19.05,44.5 IC3.7 19.05,44.5 | 19.05,44.5 20.19,45.64 20.19,50.83 20.23,50.86
  Bottom 0.152: Q10.3 69.88,11.43 75.06,11.43 76.43,12.8 81.15,12.8 82.53,11.43 Q9.3 | STDS.2 87.63,6.86 Q6.3 | 12VS.P$2 73.38,78.79 64.47,78.79 63.4,79.86 60.58,79.86 59.51,78.79 5VS.P$2 59.44,78.72 59.44,77.27 57.68,75.51 v57.68,73.99 | Q7.3 80.01,69.8 74.75,69.8 73.38,68.43 68.73,68.43 67.36,69.8 Q13.3 | 16.31,68.43 16.31,69.65 16.46,69.8 Q2.3 | 16.31,68.43 16.31,64.77 | 16.31,64.77 PCB2.GND 16.31,64.77 | 16.31,68.43 5.79,68.43 4.42,69.8 3.89,69.8 Q1.3 | IC3.12 8.91,52.12 8.91,55.7 10.21,57 11.89,57 16.46,52.43 16.46,52.12 IC3.9 | IC3.5 14.02,44.5 16.46,44.5 IC3.6 | 22.36,42.56 20.5,44.42 19.05,44.42 IC3.7 | 22.36,42.56 23.16,41.76 23.16,41.15 22.86,40.84 22.86,39.4 C2.2 | 22.36,42.56 22.33,42.52 20.19,40.39 20.19,39.85 19.05,38.71 19.05,33.07 IC2.7 19.05,32.99 19.05,31.77 22.86,27.96 C1.2 22.86,27.89 22.86,26.06 24.46,24.46 26.36,24.46 29.11,21.72 29.11,16.15 29.95,15.32 29.95,11.43 Q14.3 | 16.31,64.77 16.54,64.77 24.77,56.54 24.77,52.73 22.86,50.83 C3.2 | v38.02,69.88 41.91,69.88 Q4.3
HEATCTL  (via drill 0.35)
  Top 0.152: v9.6,36.8 9.83,37.03 9.83,41.68 8.91,42.6 8.91,44.42 IC3.3 | v14.63,30.94 14.63,30.48 14.94,30.18 14.94,27.43 15.24,27.13 16.38,27.13 18.14,28.88 18.14,30.25 19.36,31.47 25.68,31.47 26.21,30.94 38.71,30.94 40.16,29.49 47.93,29.49 48.01,29.57 48.62,29.57 50.44,31.39 53.95,31.39 v57.3,34.75 | v74.75,44.5 76.35,44.5 77.04,43.81 v79.32,43.81
  Bottom 0.152: v9.6,36.8 13.03,33.38 13.03,32 14.1,30.94 v14.63,30.94 | v57.3,34.75 57.91,34.75 57.99,34.67 64.92,34.67 v74.75,44.5 | v79.32,43.81 79.32,45.03 PCB2.32
MIXPCTL  (via drill 0.35)
  Top 0.152: v17.07,36.12 14.02,33.07 IC2.5 | v17.98,42.9 19.43,42.9 20.73,44.2 20.73,46.41 v28.27,53.95 | v34.82,55.63 40.16,55.63 48.23,63.7 48.23,64.77 PCB2.2
  Bottom 0.152: v17.07,36.12 17.07,39.24 17.98,40.16 v17.98,42.9 | v28.27,53.95 33.15,53.95 v34.82,55.63
MTDO
  Top 0.152: MTDS.4 77.5,3.81 82.75,3.81 89.15,10.21 94.26,10.21 97,12.95 98.98,12.95 99.67,13.64 99.67,32.31 92.2,39.78 92.2,51.13 87.55,55.78 87.55,57.68 86.72,58.52 85.8,58.52 85.19,59.13 85.19,61.04 86.33,62.18 PCB2.23
MTT  (via drill 0.35)
  Top 0.152: v42.98,2.06 42.22,1.29 23.85,1.29 21.34,3.81 16.54,3.81 TS1.3 | v68.66,12.5 68.66,14.71 67.21,16.15 67.21,25.53 v66.75,25.98
  Bottom 0.152: v42.98,2.06 43.89,2.06 44.04,1.91 50.37,1.91 61.27,12.8 68.35,12.8 v68.66,12.5 | v66.75,25.98 66.75,26.44 75.36,35.05 75.36,53.72 83.82,62.18 PCB2.22
N1PP  (via drill 0.35)
  Top 0.152: v15.77,14.71 13.56,16.92 9.07,16.92 4.42,21.57 3.81,21.57 IC1.1 | v32.31,7.32 32.69,7.32 33.45,8.08 v55.17,8.08
  Bottom 0.152: v15.77,14.71 16.54,14.71 23.93,7.32 v32.31,7.32 | v55.17,8.08 55.63,8.08 61.65,14.1 81.46,14.1 83.67,16.31 83.67,19.74 85.04,21.11 85.04,24.61 84.2,25.45 83.36,25.45 82.14,26.67 82.14,30.33 80.47,32 80.47,43.59 83.82,46.94 PCB2.34
N2PP  (via drill 0.35)
  Top 0.152: v17.22,9.22 19.2,9.22 19.89,9.91 32.77,9.91 33.68,8.99 34.52,8.99 v37.19,11.66 | v46.25,12.8 49.61,16.15 49.61,20.04 54.48,24.92 v54.48,25.53 | v74.75,35.36 75.89,35.36 v81.99,41.45
  Bottom 0.152: v17.22,9.22 17.22,9.68 12.04,14.86 12.04,16.46 8.91,19.58 8.91,21.57 IC1.3 | v37.19,11.66 38.33,12.8 v46.25,12.8 | v54.48,25.53 57.23,25.53 57.99,26.29 63.4,26.29 64.24,25.45 65.3,25.45 74.75,34.9 v74.75,35.36 | v81.99,41.45 81.99,42.6 83.82,44.42 PCB2.36
N3PP  (via drill 0.35)
  Top 0.152: v15.54,27.74 15.54,30.18 16.84,31.47 16.92,31.47 18.14,32.69 18.14,34.06 20.88,36.8 38.1,36.8 40.23,34.67 41.6,34.67 44.2,37.26 47.02,37.26 53.03,43.28 57.3,43.28 59.51,45.49 59.51,47.7 v59.21,48.01 | v71.25,50.98 74.75,50.98 PCB2.38
  Bottom 0.152: v15.54,27.74 14.02,26.21 14.02,21.64 IC1.5 | v59.21,48.01 63.17,48.01 65.84,50.67 70.94,50.67 v71.25,50.98
N4PP  (via drill 0.35)
  Top 0.152: v20.8,27.66 22.63,29.49 v28.57,29.49 | v36.35,31.55 36.35,32.38 v36.73,32.77 | v39.4,38.33 39.85,38.33 39.93,38.25 41.83,38.25 v48.31,44.73 | v59.51,53.19 59.51,53.65 63.4,57.53 63.4,62.94 64.85,64.39 64.85,66.29 65.68,67.13 67.89,67.13 69.95,65.08 69.95,56.62 83.44,43.13 84.28,43.13 85.04,42.37 85.04,40.62 83.82,39.4 PCB2.40
  Bottom 0.152: v20.8,27.66 18.67,27.66 17.14,29.18 16.54,29.18 IC1.9 | v28.57,29.49 29.03,29.49 29.87,28.65 33.45,28.65 v36.35,31.55 | v36.73,32.77 37.64,32.77 39.4,34.52 v39.4,38.33 | v48.31,44.73 53.19,49.61 53.19,50.67 55.7,53.19 v59.51,53.19
N5PP  (via drill 0.35)
  Top 0.152: v68.28,71.17 68.28,76.43 66.14,78.56 64.77,78.56 63.78,77.57 61.57,77.57 61.34,77.8 61.34,78.33 59.89,79.78 23.7,79.78 9.98,66.06 9.98,64.39 9.53,63.93 9.53,54.56 10.21,53.87 10.21,32.31 11.43,31.09 11.43,29.26 IC1.11 | v65.99,66.52 67.36,65.15 67.36,53.95 76.89,44.42 79.93,44.42 82.6,41.76 82.6,38.1 83.82,36.88 PCB2.42
  Bottom 0.152: v68.28,71.17 66.83,71.17 65.99,70.33 v65.99,66.52
N6PP  (via drill 0.35)
  Top 0.152: v9.91,23.62 13.56,23.62 v14.71,24.77 | v21.57,22.71 23.16,21.11 26.14,21.11 27.66,22.63 38.33,22.63 39.32,21.64 v39.32,21.34 | v53.57,24.92 v48.62,19.96 | PCB2.44 v75.97,34.29
  Bottom 0.152: v9.91,23.62 6.4,27.13 6.4,29.18 IC1.13 | v14.71,24.77 19.51,24.77 v21.57,22.71 | v39.32,21.34 40.69,19.96 v48.62,19.96 | v53.57,24.92 57.61,24.92 58.06,24.46 66.14,24.46 v75.97,34.29
N$1  (via drill 0.35)
  Top 0.254: v6.4,47.85 5.26,46.71 5.26,28.5 2.74,25.98 2.74,20.5 3.35,19.89 4.34,19.89 6.55,17.68 6.55,16.08 7.16,15.47 8.69,15.47 11.81,12.34 11.81,10.97 12.8,9.98 18.29,9.98 19.74,11.43 22.1,11.43 D2.A | v10.67,54.48 11.05,54.48 19.96,63.4 32,63.4 32.84,64.24 32.84,65.3 31.24,66.9 v21.87,66.9 | v31.39,72.01 21.11,72.01 19.13,70.03 19.13,69.88 Q2.2
  Bottom 0.254: v6.4,47.85 8.91,50.37 9.37,50.37 10.36,51.36 10.36,54.18 v10.67,54.48 | v21.87,66.9 19.13,69.65 19.13,69.8 Q2.2 | v31.39,72.01 36.8,77.42 MIXP.2
N$2
  Bottom 0.254: D3.A 38.1,34.75 37.87,34.75 36.73,33.6 30.02,33.6 26.75,36.88 26.75,57.23 27.89,58.37 NP1.2 27.96,58.52 32.84,63.4 32.84,65.3 31.77,66.37 31.77,69.8 Q3.2
N$3  (via drill 0.35)
  Top 0.152: v32.99,38.33 30.48,38.33 29.11,39.7 29.11,41.83 28.42,42.52 27.51,42.52 22.71,37.72 21.18,37.72 19.05,39.85 19.05,40.62 IC2.8 | v36.65,34.67 39.55,31.77 46.94,31.77 48.23,30.48 R1.1 48.31,30.48 49.53,31.7 50.75,31.7 55.85,36.8 v58.45,36.8 | v78.87,58.98 83.29,63.4 86.87,63.4 90.14,60.12 90.14,57.15 R5.1
  Bottom 0.152: v36.65,34.67 v32.99,38.33 | v78.87,58.98 78.87,57.68 69.34,48.16 69.34,42.67 66.67,40.01 61.65,40.01 v58.45,36.8
N$4  (via drill 0.35)
  Top 0.152: v42.37,47.17 30.48,47.17 29.03,48.62 29.03,50.75 28.35,51.44 27.51,51.44 25.98,49.91 v25.98,49.84
  Bottom 0.152: v42.37,47.17 44.27,47.17 50.75,40.69 56.24,40.69 58.37,38.56 58.37,38.1 R8.2 | v25.98,49.84 25.98,60.96 22.63,64.31 22.63,68.81 21.64,69.8 Q2.1
N$5
  Bottom 0.152: R5.2 90.14,64.77 90.14,69.88 85.04,74.98 67.36,74.98 64.54,72.16 32.61,72.16 31.7,71.25 10.29,71.25 8.91,69.88 Q1.1
N$6
  Top 0.152: 47.28,28.38 48.16,29.26 48.77,29.26 49.99,30.48 50.75,30.48 R4.1 | 47.28,28.38 47.24,28.35 47.24,26.59 40.92,20.27 39.55,20.27 38.1,18.82 9.68,18.82 6.93,21.57 6.4,21.57 IC1.2 | R3.1 40.69,27.96 41.53,27.96 42.75,29.18 46.48,29.18 47.24,28.42 47.28,28.38
N$7  (1 unrouted)
N$8  (via drill 0.35)
  Top 0.152: v60.73,53.95 60.73,33.91 58.45,31.62 58.45,30.48 R4.2 | v53.8,61.57 v57.68,57.68
  Bottom 0.152: v60.73,53.95 60.73,54.63 v57.68,57.68 | v53.8,61.57 42.14,61.57 39.32,64.39 39.32,65.23 34.75,69.8 34.29,69.8 Q3.1
N$9
  Top 0.152: IC2.6 16.54,33.07 16.69,33.07 20.73,37.11 39.09,37.11 40.62,35.59 R2.1 40.69,35.59 42.67,37.57 44.81,37.57 51.51,44.27 51.51,44.35 52.88,45.72 58.37,45.72 R8.1
N$10  (via drill 0.35)  (1 unrouted)
  Top 0.254: v13.11,76.5 13.11,74.45 9.98,71.32 7.7,71.32 6.4,70.03 6.4,69.88 Q1.2
  Bottom 0.254: v13.11,76.5 16,79.4 39.85,79.4 41.76,77.5 46.94,77.5 SUPP.2
N$11
  Top 0.254: D4.A 14.78,55.93 21.34,55.93 25.76,60.35 30.94,60.35 33.38,57.91 33.38,55.85 34.37,54.86 44.73,54.86 48.23,58.37 NP3.2 48.31,58.52 50.14,60.35 50.83,60.35 54.71,64.24 54.71,65.3 53.87,66.14 48.08,66.14 45.57,68.66 45.57,68.73 44.5,69.8 Q4.2
N$12  (via drill 0.35)
  Top 0.152: v12.95,15.7 10.97,15.7 10.21,16.46 7.62,16.46 R9.1 | v37.95,20.12 19.51,20.12 19.43,20.04 18.06,20.04 16.54,21.57 IC1.6
  Bottom 0.152: v12.95,15.7 12.95,18.06 16.46,21.57 IC1.6 | v37.95,20.12 38.71,19.36 49.68,19.36 50.67,18.36 57.15,18.36 57.53,17.98 62.03,17.98 63.48,19.43 63.48,20.27 R7.1
N$13  (via drill 0.35)
  Top 0.152: v66.6,20.19 61.42,25.38 58.45,25.38 R11.2 | v68.81,17.98 69.95,16.84 69.95,16 75.89,10.06 86.26,10.06 Q6.1
  Bottom 0.152: v68.81,17.98 v66.6,20.19
N$14  (via drill 0.35)
  Top 0.152: v38.94,18.75 38.71,18.52 18.06,18.52 16.08,16.54 15.24,16.54 R9.2 | v71.78,28.73 71.78,36.04 67.82,40.01 67.82,49.23 65.91,51.13 65.91,58.22 66.14,58.45 v66.14,60.43
  Bottom 0.152: v38.94,18.75 38.41,18.75 37.26,19.89 37.26,21.11 37.19,21.18 37.19,21.95 37.72,22.48 38.86,22.48 39.24,22.1 44.96,22.1 46.86,24 54.63,24 54.94,24.31 57.3,24.31 57.76,23.85 66.9,23.85 v71.78,28.73 | v66.14,60.43 62.18,64.39 62.18,69.8 60.73,71.25 48.39,71.25 47.02,69.88 Q4.1
N$15
  Bottom 0.254: D5.A 30.48,34.82 30.48,38.25 38.1,45.87 NP5.2 38.18,49.61 40.01,51.44 46.94,51.44 56.92,61.42 56.92,65.15 57.15,65.38 57.15,69.8 Q5.2
N$16  (via drill 0.35)
  Top 0.152: v46.86,50.44 42.98,46.56 25.68,46.56 25.53,46.71 22.4,46.71 21.34,45.64 21.34,43.89 19.74,42.29 18.75,42.29 18.14,41.68 18.14,40.31 16.92,39.09 16.08,39.09 13.03,36.04 13.03,32 13.95,31.09 13.95,29.26 IC1.10 | R12.1 49.53,36.88 55.09,36.88 59.82,41.6 59.82,49.45 58.45,50.83 58.45,54.56 R10.1
  Bottom 0.152: v46.86,50.44 50.14,53.72 57.53,53.72 58.37,54.56 R10.1
N$17  (via drill 0.35)
  Top 0.152: v14.63,36.73 19.89,36.73 20.57,37.41 24.54,37.41 v24.84,37.72 | v41.76,32.38 47.47,32.38 47.85,32 49.76,32 50.75,32.99 R6.1
  Bottom 0.152: R11.1 50.75,25.45 49.68,25.45 48.23,26.9 45.49,26.9 44.12,28.27 44.12,28.88 47.24,32 49.76,32 50.75,32.99 R6.1 | v14.63,36.73 10.82,36.73 8,39.55 8,40.92 6.4,42.52 6.4,44.42 IC3.2 | v24.84,37.72 24.84,35.05 27.74,32.16 40.23,32.16 40.31,32.08 41.45,32.08 v41.76,32.38
N$18
  Top 0.152: R12.2 49.53,44.5 49.53,45.95 53.19,49.61 53.19,62.03 59.66,68.5 59.66,69.8 Q5.1
N$19  (via drill 0.35)
  Top 0.254: v28.73,36.04 27.51,34.82 26.67,34.82 D7.A | v49.53,63.4 v42.82,56.69 | PHDPP.2 26.67,77.42 28.57,75.51 31.24,75.51 v35.97,70.79 36.04,70.87 37.49,72.31 54.79,72.31 57.23,74.75 62.64,74.75 63.32,74.07 63.32,71.78 v67.13,67.97
  Bottom 0.254: v28.73,36.04 28.73,39.01 29.34,39.62 29.34,43.2 v42.82,56.69 | v49.53,63.4 53.87,63.4 54.71,64.24 54.71,65.3 51.59,68.43 38.33,68.43 v35.97,70.79 | v67.13,67.97 80.16,67.97 81.99,69.8 82.53,69.8 Q7.2
N$20  (via drill 0.35)
  Top 0.152: v9.75,24.69 9.75,24.38 9.3,23.93 9.3,23.16 10.52,21.95 10.52,20.57 11.05,20.04 14.4,20.04 15.62,21.26 15.62,22.63 20.04,27.05 21.11,27.05 21.95,27.89 21.95,28.35 22.48,28.88 31.55,28.88 32.84,30.18 36.65,30.18 v36.8,30.02 | v42.52,34.67 45.95,34.67 49.26,37.99 | 49.26,37.99 51.97,40.69 56.39,40.69 v57.53,41.83 | v65.68,30.56 73.61,22.63 73.61,20.34 R14.1 | v49.15,38.02 49.23,38.02 49.26,37.99
  Bottom 0.152: v9.75,24.69 8,26.44 8,29.49 6.4,31.09 6.4,32.99 IC2.2 | v36.8,30.02 37.26,30.02 39.01,31.77 42.06,31.77 42.52,32.23 v42.52,34.67 | v57.53,41.83 57.53,47.32 60.12,49.91 60.12,54.18 58.75,55.55 56.84,55.55 55.93,54.63 R13.1 | v65.68,30.56 59.66,30.56 58.6,31.62 56.01,31.62 49.61,38.02 v49.15,38.02
N$21  (via drill 0.35)
  Top 0.152: D6.A 2.06,11.43 2.06,10.82 10.97,1.91 11.89,1.91 12.95,2.97 12.95,5.03 16.08,8.15 19.13,8.15 19.74,7.54 31.62,7.54 32.46,8.38 54.56,8.38 55.93,9.75 88.24,9.75 Q6.2 | v68.73,42.98 68.73,40.46 77.19,32 v81.38,32
  Bottom 0.152: v68.73,42.98 64.77,46.94 K1.1 | v81.38,32 81.38,31.55 82.6,30.33 82.6,28.73 83.44,27.89 84.28,27.89 85.19,26.98 85.19,26.14 86.03,25.3 86.87,25.3 89.92,22.25 Q6.2
N$22
  Bottom 0.152: R14.2 81.23,20.34 81.23,29.87 78.72,32.38 78.72,56.31 83.44,61.04 84.35,61.04 85.04,61.72 85.04,69.8 Q7.1
N$23  (via drill 0.35)
  Top 0.254: D8.A 23.39,60.96 35.59,60.96 38.1,58.45 NP2.2 | v79.48,40.01 78.11,40.01 v66.67,51.44 | v53.95,59.59 v55.09,58.45
  Bottom 0.254: v79.48,40.01 79.48,32.31 81.69,30.1 81.69,21.79 82.6,20.88 82.6,15.93 81.53,14.86 58.52,14.86 55.09,11.43 54.63,11.43 Q8.2 | v66.67,51.44 59.66,58.45 v55.09,58.45 | v53.95,59.59 52.05,59.59 51.28,60.35 40.01,60.35 38.1,58.45 NP2.2
N$24  (via drill 0.35)
  Top 0.152: v25.22,30.25 22.48,30.25 16.38,24.16 14.55,24.16 12.04,21.64 11.43,21.64 IC1.4 | v26.52,31.55 29.64,31.55 33.98,35.89 38.56,35.89 40.58,33.87 | 40.58,33.87 40.62,33.83 40.62,33.07 R15.1 | R16.1 50.75,35.51 49.68,35.51 48.23,34.06 40.77,34.06 40.62,33.91 40.58,33.87
  Bottom 0.152: v26.52,31.55 v25.22,30.25
N$25
  Top 0.152: R16.2 58.37,35.51 58.37,34.9 55.09,31.62 55.09,24.61 52.12,21.64 52.12,11.43 Q8.1
N$26  (via drill 0.35)
  Top 0.254: v25.98,47.32 25.98,47.62 27.89,49.53 NP4.2 | v56.24,6.71 33.3,6.71 v33.22,6.78 | v24.46,22.94 24.46,24.92 v24.77,25.22 | v22.4,41.45 22.4,42.9 22.86,43.36 v22.86,44.42
  Bottom 0.254: 22.86,44.65 23.32,44.65 v25.98,47.32 | 22.86,44.65 21.79,44.65 15.47,50.98 15.47,52.73 12.34,55.85 10.74,55.85 D9.A | v56.24,6.71 57.76,8.23 76.89,8.23 79.93,11.28 79.93,11.43 Q9.2 | v33.22,6.78 33.22,7.54 31.01,9.75 22.17,9.75 16.46,15.47 16.46,17.07 18.44,19.05 20.57,19.05 v24.46,22.94 | v24.77,25.22 24.77,28.19 20.65,32.31 20.65,39.7 v22.4,41.45 | v22.86,44.42 22.86,44.58 22.86,44.65
N$27  (via drill 0.35)
  Top 0.152: 40.62,26.59 40.62,26.67 37.41,29.87 37.41,30.33 37.11,30.63 25.76,30.63 25.53,30.86 20.65,30.86 19.05,29.26 IC1.8 | 40.62,26.59 40.62,25.45 R17.1 | v44.73,28.57 42.6,28.57 40.62,26.59
  Bottom 0.152: v44.73,28.57 45.11,28.96 48.69,28.96 49.68,27.96 50.75,27.96 R18.1
N$28
  Top 0.152: R18.2 58.45,27.89 65.76,27.89 70.1,23.55 70.1,19.2 72.47,16.84 72.47,16 77.04,11.43 77.42,11.43 Q9.1
N$29  (via drill 0.35)
  Top 0.254: v8.08,48.39 7.85,48.62 7.85,57.23 2.29,62.79 2.29,70.33 6.86,74.91 11.89,74.91 D10.A | v25.98,43.66 35.43,43.66 37.87,46.1 44.81,46.1 48.23,49.53 NP6.2 | v61.72,18.75 61.72,16.38 62.94,15.16 63.7,15.16 67.28,11.58 67.28,11.43 Q10.2 | v40.39,21.34 40.39,21.79 35.43,26.75 35.43,27.13 v33.15,29.41
  Bottom 0.254: v8.08,48.39 17.3,48.39 22.02,43.66 24.08,43.66 | v25.98,43.66 24.08,43.66 | v61.72,18.75 60.81,18.75 60.73,18.67 57.53,18.67 57.38,18.82 50.9,18.82 49,20.73 46.33,20.73 46.1,20.5 41.22,20.5 v40.39,21.34 | v33.15,29.41 29.79,29.41 24.08,35.13 24.08,43.59 24.08,43.66
N$30  (via drill 0.35)
  Top 0.152: v12.42,67.59 24.16,79.32 42.82,79.32 48.46,73.69 54.56,73.69 R20.1
  Bottom 0.152: v12.42,67.59 12.42,59.89 8,55.47 8,51.74 5.41,49.15 5.41,39.4 7.24,37.57 7.24,32.69 8.84,31.09 8.84,29.26 IC1.12 | R19.1 64.77,73.61 63.48,73.61 62.64,72.77 55.47,72.77 54.63,73.61 R20.1
N$31
  Top 0.152: Q10.1 60.96,15.24 60.96,20.34 57.38,23.93 57.38,33.45 57.99,34.06 58.22,34.06 60.12,35.97 60.12,49.61 58.9,50.83 58.9,53.49 62.18,56.77 62.18,73.61 R20.2
N$32  (via drill 0.35)
  Top 0.254: v92.51,32.99 92.51,26.21 91.44,25.15 91.44,24.69 D11.A 91.36,24.61 87.02,20.27 83.21,20.27 82.07,21.41 77.95,21.41 67.36,32 67.36,47.47 66.83,48.01 v66.83,48.39 | v58.75,47.02 58.52,46.79 53.26,46.79 51.05,44.58 51.05,44.5 49.91,43.36 47.78,43.36 41.99,37.57 30.56,37.57 27.96,40.16 27.96,40.62 PHUPP.2
  Bottom 0.254: v92.51,32.99 92.51,38.33 90.22,40.62 Q11.2 | v58.75,47.02 62.87,47.02 64.24,48.39 v66.83,48.39
N$33  (via drill 0.35)
  Top 0.152: v40.62,71.55 34.37,65.3 34.37,65.08 32.23,62.94 20.19,62.94 10.52,53.26 10.52,39.62 11.43,38.71 11.43,33.07 IC2.4
  Bottom 0.152: v40.62,71.55 67.74,71.55 68.81,72.62 73.91,72.62 74.91,73.61 R21.1 74.98,73.69 75.97,74.68 82.98,74.68 83.97,73.69 85.04,73.69 R22.1
N$34
  Bottom 0.152: R22.2 92.66,73.61 92.66,63.93 89.15,60.43 89.15,44.2 90.14,43.2 Q11.1
N$35  (via drill 0.35)
  Top 0.254: v9.22,67.51 16.46,74.75 16.46,77.42 RORP.2
  Bottom 0.254: 36.73,3.89 39.32,1.29 92.58,1.29 99.75,8.46 99.75,48.77 98.15,50.37 98.07,50.37 95.25,53.19 95.25,62.56 94.03,63.78 94.03,70.33 D12.A | 36.73,3.89 36.73,6.17 41.83,11.28 41.83,11.43 Q12.2 | v9.22,67.51 3.89,67.51 2.29,65.91 2.29,62.79 3.2,61.87 3.2,53.65 2.74,53.19 2.74,24.84 4.95,22.63 4.95,19.28 6.55,17.68 6.55,14.33 2.21,9.98 2.13,9.98 1.45,9.3 1.45,8.46 8.46,1.45 34.29,1.45 36.65,3.81 36.73,3.89
N$36  (via drill 0.35)
  Top 0.152: v5.56,23.16 7.32,23.16 12.34,28.19 12.34,35.81 13.95,37.41 13.95,40.62 IC2.10
  Bottom 0.152: 8.53,8.84 8.91,8.84 9.75,8 11.81,8 12.65,8.84 R23.1 | 8.53,8.84 2.59,8.84 R24.1 | v5.56,23.16 5.56,22.78 5.41,22.63 5.41,20.04 8.53,16.92 8.53,8.84
N$37
  Top 0.152: R24.2 10.21,8.84 11.43,8.84 12.27,8 15.47,8 15.93,8.46 19.28,8.46 19.89,7.85 31.47,7.85 32.31,8.69 36.58,8.69 39.32,11.43 Q12.1
N$38  (via drill 0.35)
  Top 0.254: 71.17,71.25 69.8,69.88 Q13.2 | 71.17,71.25 71.25,71.32 73.53,71.32 76.43,68.43 84.58,68.43 87.71,65.3 87.71,63.93 93.95,57.68 D13.A | v49.61,47.17 41.15,38.71 40.16,38.71 38.25,40.62 38.1,40.62 WV.2 | v53.95,52.96 53.95,54.18 56.69,56.92 58.06,56.92 61.65,60.5 61.65,61.34 59.59,63.4 56.69,63.4 v56.16,63.93 | v58.22,68.12 v56.16,66.06 | v60.58,68.12 61.11,68.66 61.11,73.76 v60.88,73.99 | v62.94,76.2 63.48,76.2 64.92,74.75 66.83,74.75 v67.51,74.07 | v69.04,73.38 71.09,71.32 71.17,71.25
  Bottom 0.254: v49.61,47.17 49.61,50.75 51.82,52.96 v53.95,52.96 | v56.16,66.06 v56.16,63.93 | v60.58,68.12 v58.22,68.12 | v60.88,73.99 60.88,74.14 v62.94,76.2 | v67.51,74.07 68.35,74.07 v69.04,73.38
N$39  (via drill 0.35)
  Top 0.152: R25.1 90.14,46.94 88.77,45.57 88.77,37.72 89.69,36.8 90.22,36.8 92.35,34.67 92.35,33.91 91.44,32.99 R26.1 90.22,25.45 83.44,25.45 v80.62,22.63 | v18.82,7.54 19.28,7.54 21.11,5.71 26.98,5.71 28.12,4.57 28.12,2.59 28.8,1.91 35.13,1.91 v37.49,4.27
  Bottom 0.152: v18.82,7.54 18.82,8.53 12.34,15.01 12.34,25.45 15.24,28.35 15.24,37.03 14.94,37.34 12.8,37.34 9.53,40.62 8.91,40.62 IC2.12 | v37.49,4.27 43.36,10.13 48.39,10.13 53.57,15.32 60.58,15.32 67.89,22.63 v80.62,22.63
N$40
  Top 0.152: R26.2 91.44,34.59 87.55,38.48 87.55,44.96 86.72,45.8 85.88,45.8 85.04,46.63 85.04,47.47 84.2,48.31 83.36,48.31 72.39,59.28 72.39,69.8 Q13.1
N$41  (via drill 0.35)
  Top 0.152: 38.14,32.27 38.94,31.47 45.95,31.47 v47.02,30.4 | 38.14,32.27 35.66,34.75 34.29,34.75 D14.A | v25.83,21.72 26.29,21.72 29.34,24.77 31.09,24.77 v32.77,26.44 | v37.41,31.55 38.1,32.23 38.14,32.27
  Bottom 0.152: v47.02,30.4 48.16,29.26 55.78,29.26 58.37,26.67 K2.1 | v25.83,21.72 26.59,20.95 26.59,16.15 27.66,15.09 27.66,11.43 Q14.2 | v32.77,26.44 32.77,26.9 v37.41,31.55
N$42  (1 unrouted)
N$43  (via drill 0.35)
  Top 0.152: v44.35,13.41 46.94,16 46.94,16.99 45.72,18.21 45.72,21.57 R28.2
  Bottom 0.152: v44.35,13.41 38.02,13.41 35.51,10.9 31.17,10.9 30.48,10.21 26.67,10.21 25.45,11.43 Q14.1
N$44
  Top 0.152: R27.1 27.96,21.57 34.14,21.57 35.13,20.57 37.11,20.57 38.1,21.57 R28.1
  Bottom 0.152: IC3.4 11.43,44.42 11.43,42.6 13.03,41 13.03,39.62 15.01,37.64 15.09,37.64 16.46,36.27 16.46,35.05 18.14,33.38 18.14,32 19.36,30.79 19.43,30.79 21.95,28.27 21.95,26.52 26.82,21.64 27.89,21.64 R27.1
PHDPP  (via drill 0.35)
  Top 0.152: v11.28,16.31 13.26,16.31 15.47,14.1 17.07,14.1 19.13,16.15 19.13,16.99 19.81,17.68 33.53,17.68 34.29,16.92 34.29,15.93 34.98,15.24 37.64,15.24 40.08,17.68 v44.81,17.68 | v54.63,17.37 55.02,17.37 56.62,18.97 59.89,18.97 v60.35,19.43 | v77.27,28.73 79.1,28.73 82.07,31.7 83.82,31.7 PCB2.46
  Bottom 0.152: v11.28,16.31 8,19.58 8,23.7 5.41,26.29 5.41,29.72 3.81,31.32 3.81,32.99 IC2.1 | v44.81,17.68 54.33,17.68 v54.63,17.37 | v60.35,19.43 61.34,19.43 65.46,23.55 72.08,23.55 v77.27,28.73
PHUPP  (via drill 0.35)
  Top 0.152: v7.01,23.77 7.24,24 7.24,29.49 8.84,31.09 8.84,32.99 IC2.3 | v34.67,10.29 34.67,11.81 v34.29,12.19 | v80.62,25.98 83.82,29.18 PCB2.48
  Bottom 0.152: v7.01,23.77 7.01,22.86 7.7,22.17 7.7,18.21 12.34,13.56 12.34,10.52 13.64,9.22 13.64,8.38 10.29,5.03 10.29,2.59 10.97,1.91 32.08,1.91 34.67,4.5 v34.67,10.29 | v34.29,12.19 34.75,12.19 35.43,12.88 37.03,12.88 39.47,15.32 41.15,15.32 41.99,16.15 41.99,16.99 43.28,18.29 50.29,18.29 50.6,17.98 57.07,17.98 57.38,17.68 62.48,17.68 68.05,23.24 77.88,23.24 v80.62,25.98
RORPCTL  (via drill 0.35)
  Top 0.152: v18.59,55.17 17.68,55.17 15.62,53.11 15.62,44.12 14.4,42.9 14.25,42.9 12.04,40.69 11.43,40.69 IC2.11 | v18.59,57.76 23.47,62.64 41,62.64 43.13,64.77 PCB2.4
  Bottom 0.152: v18.59,57.76 v18.59,55.17
RRTDO  (via drill 0.35)
  Top 0.152: v89.31,13.26 90.75,13.26 93.88,16.38 v93.88,32.69 | v93.88,37.19 93.88,37.64 91.9,39.62 91.9,50.98 86.41,56.46 86.41,57.15 PCB2.27
  Bottom 0.152: v89.31,13.26 87.17,13.26 81.69,7.77 71.48,7.77 67.51,3.81 62.26,3.81 RRTDS.4 | v93.88,37.19 v93.88,32.69
STDO
  Top 0.152: STDS.4 92.73,3.81 92.73,4.04 99.97,11.28 99.97,32.46 92.51,39.93 92.51,53.72 89.99,56.24 89.76,56.24 86.33,59.66 PCB2.25
SUPPCTL  (via drill 0.35)
  Top 0.152: v32.99,55.09 30.33,55.09 21.03,45.8 21.03,44.04 19.58,42.6 18.59,42.6 16.69,40.69 16.54,40.69 IC2.9 | v34.14,56.24 38.25,56.24 39.55,57.53 39.55,59.66 43.43,63.55 44.5,63.55 PCB2.3
  Bottom 0.152: v34.14,56.24 v32.99,55.09
SWTDO  (via drill 0.35)
  Top 0.152: v79.93,13.49 83.74,17.3 83.74,17.75 85.8,19.81 88.16,19.81 93.27,24.92 v93.27,31.17
  Bottom 0.152: v79.93,13.49 61.49,13.49 51.82,3.81 47.02,3.81 SWTDS.4 | v93.27,31.17 87.86,36.58 87.86,50.6 86.41,52.05 PCB2.31
TDS1
  Bottom 0.152: TDS1.3 97.77,16.54 97.77,21.79 87.55,32 87.55,50.06 86.72,50.9 85.8,50.9 85.04,51.66 85.04,58.45 83.82,59.66 PCB2.24
TDS2
  Top 0.152: PCB2.26 85.04,55.93 85.04,54.25 85.88,53.42 86.72,53.42 91.59,48.54 91.59,38.56 97.77,32.38 97.77,29.26 TDS2.3
UVCTL  (via drill 0.35)
  Top 0.152: v5.41,57.3 5.41,51.59 3.81,49.99 3.81,44.5 IC3.1 | v11.35,63.25 12.42,64.31 12.42,65.3 14.78,67.67 31.17,67.67 v33.6,65.23 | v60.88,60.96 v55.32,60.96 | v77.34,57.07 78.87,57.07 83.82,52.12 PCB2.30
  Bottom 0.152: v11.35,63.25 v5.41,57.3 | v33.6,65.23 33.6,65 37.64,60.96 v55.32,60.96 | v60.88,60.96 64.77,57.07 v77.34,57.07
WVCTL  (via drill 0.35)
  Top 0.152: v11.66,19.43 38.25,19.43 39.4,20.57 40.69,20.57 44.42,24.31 v44.42,24.69 | v80.62,29.34 82.22,29.34 83.29,30.4 85.19,30.4 86.33,29.26 PCB2.49
  Bottom 0.152: v11.66,19.43 10.52,20.57 10.52,34.75 6.4,38.86 6.4,40.62 IC2.13 | v44.42,24.69 47.55,24.69 47.93,24.31 54.48,24.31 54.79,24.61 57.45,24.61 57.91,24.16 66.29,24.16 71.48,29.34 v80.62,29.34
WWTDO  (via drill 0.35)
  Top 0.152: v83.74,7.47 v34.06,7.47 | v82.6,56.24 82.6,57.61 83.36,58.37 84.28,58.37 85.19,57.45 85.19,56.24 86.33,55.09 86.33,54.63 PCB2.29
  Bottom 0.152: v34.06,7.47 34.06,6.55 31.77,4.27 31.77,3.81 WWTDS.4 | v83.74,7.47 86.64,4.57 86.64,2.59 87.17,2.06 88.09,2.06 89.08,3.05 89.08,6.55 93.42,10.9 93.42,21.11 87.55,26.98 87.55,29.72 86.72,30.56 85.88,30.56 85.04,31.39 85.04,49.99 84.12,50.9 83.29,50.9 82.6,51.59 v82.6,56.24

### Text on the board
tNames: 5V | 12V | 240VAC | APFC ACTL V0.1 | UVLIGHT